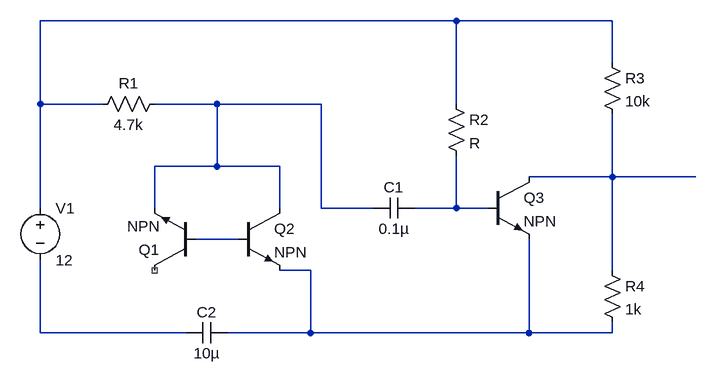
[diagram p0: schematic random_noise_generator.asc]
random_noise_generator.asc, the LTspice schematic file:
Version 4.1
SHEET 1 1060 680
WIRE 688 -160 48 -160
WIRE 928 -160 688 -160
WIRE 928 -96 928 -160
WIRE 48 -32 48 -160
WIRE 144 -32 48 -32
WIRE 320 -32 224 -32
WIRE 480 -32 320 -32
WIRE 688 -32 688 -160
WIRE 320 64 320 -32
WIRE 320 64 224 64
WIRE 416 64 320 64
WIRE 928 80 928 -16
WIRE 928 80 800 80
WIRE 1056 80 928 80
WIRE 48 128 48 -32
WIRE 224 128 224 64
WIRE 416 128 416 64
WIRE 480 128 480 -32
WIRE 560 128 480 128
WIRE 688 128 688 48
WIRE 688 128 624 128
WIRE 736 128 688 128
WIRE 352 176 288 176
WIRE 464 224 416 224
WIRE 928 224 928 80
WIRE 48 320 48 208
WIRE 272 320 48 320
WIRE 464 320 464 224
WIRE 464 320 336 320
WIRE 800 320 800 176
WIRE 800 320 464 320
WIRE 928 320 928 304
WIRE 928 320 800 320
SYMBOL voltage 48 112 R0
SYMATTR InstName V1
SYMATTR Value 12
SYMBOL npn 288 224 R180
SYMATTR InstName Q1
SYMBOL npn 352 128 R0
SYMATTR InstName Q2
SYMBOL res 240 -48 R90
WINDOW 0 0 56 VBottom 2
WINDOW 3 32 56 VTop 2
SYMATTR InstName R1
SYMATTR Value 4.7k
SYMBOL cap 624 112 R90
WINDOW 0 0 32 VBottom 2
WINDOW 3 32 32 VTop 2
SYMATTR InstName C1
SYMATTR Value 0.1µ
SYMBOL res 672 -48 R0
SYMATTR InstName R2
SYMBOL cap 336 304 R90
WINDOW 0 0 32 VBottom 2
WINDOW 3 32 32 VTop 2
SYMATTR InstName C2
SYMATTR Value 10µ
SYMBOL npn 736 80 R0
SYMATTR InstName Q3
SYMBOL res 912 -112 R0
SYMATTR InstName R3
SYMATTR Value 10k
SYMBOL res 912 208 R0
SYMATTR InstName R4
SYMATTR Value 1k

The netlist it stands for:
* random_noise_generator.asc
V1 N001 N007 12
Q1 NC_01 N005 N002 0 NPN
Q2 N002 N005 N006 0 NPN
R1 N002 N001 4.7k
C1 N004 N002 0.1µ
R2 N001 N004 R
C2 N006 N007 10µ
Q3 N003 N004 N006 0 NPN
R3 N001 N003 10k
R4 N003 N006 1k
.model NPN NPN
.model PNP PNP
.lib standard.bjt
.backanno
.end